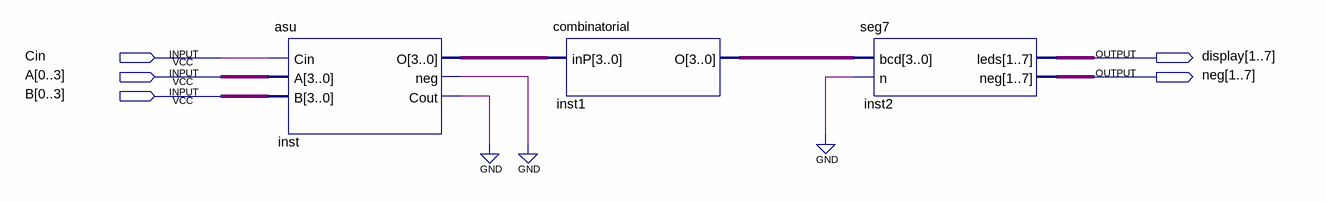
[diagram p0: schematic sheet]
// Quartus schematic CombinedASU2.bdf as structural Verilog: 3 symbols, 5 pins
module CombinedASU2 (
  input  Cin,
  input  [0:3] A,
  input  [0:3] B,
  output [1:7] display,
  output [1:7] neg
);

  wire inst_cout, inst_neg;
  wire [3:0] inst1_o, inst_o;

  asu inst (.Cin(Cin), .A(A), .B(B), .O(inst_o), .neg(inst_neg), .Cout(inst_cout));
  combinatorial inst1 (.inP(inst_o), .O(inst1_o));
  seg7 inst2 (.bcd(inst1_o), .n(1'b0), .leds(display), .neg(neg));
  // also tied to GND on the sheet: {inst_neg, inst_cout}
endmodule
